# EAGLE design Rib-BabyBack (EAGLE 8.6.3)
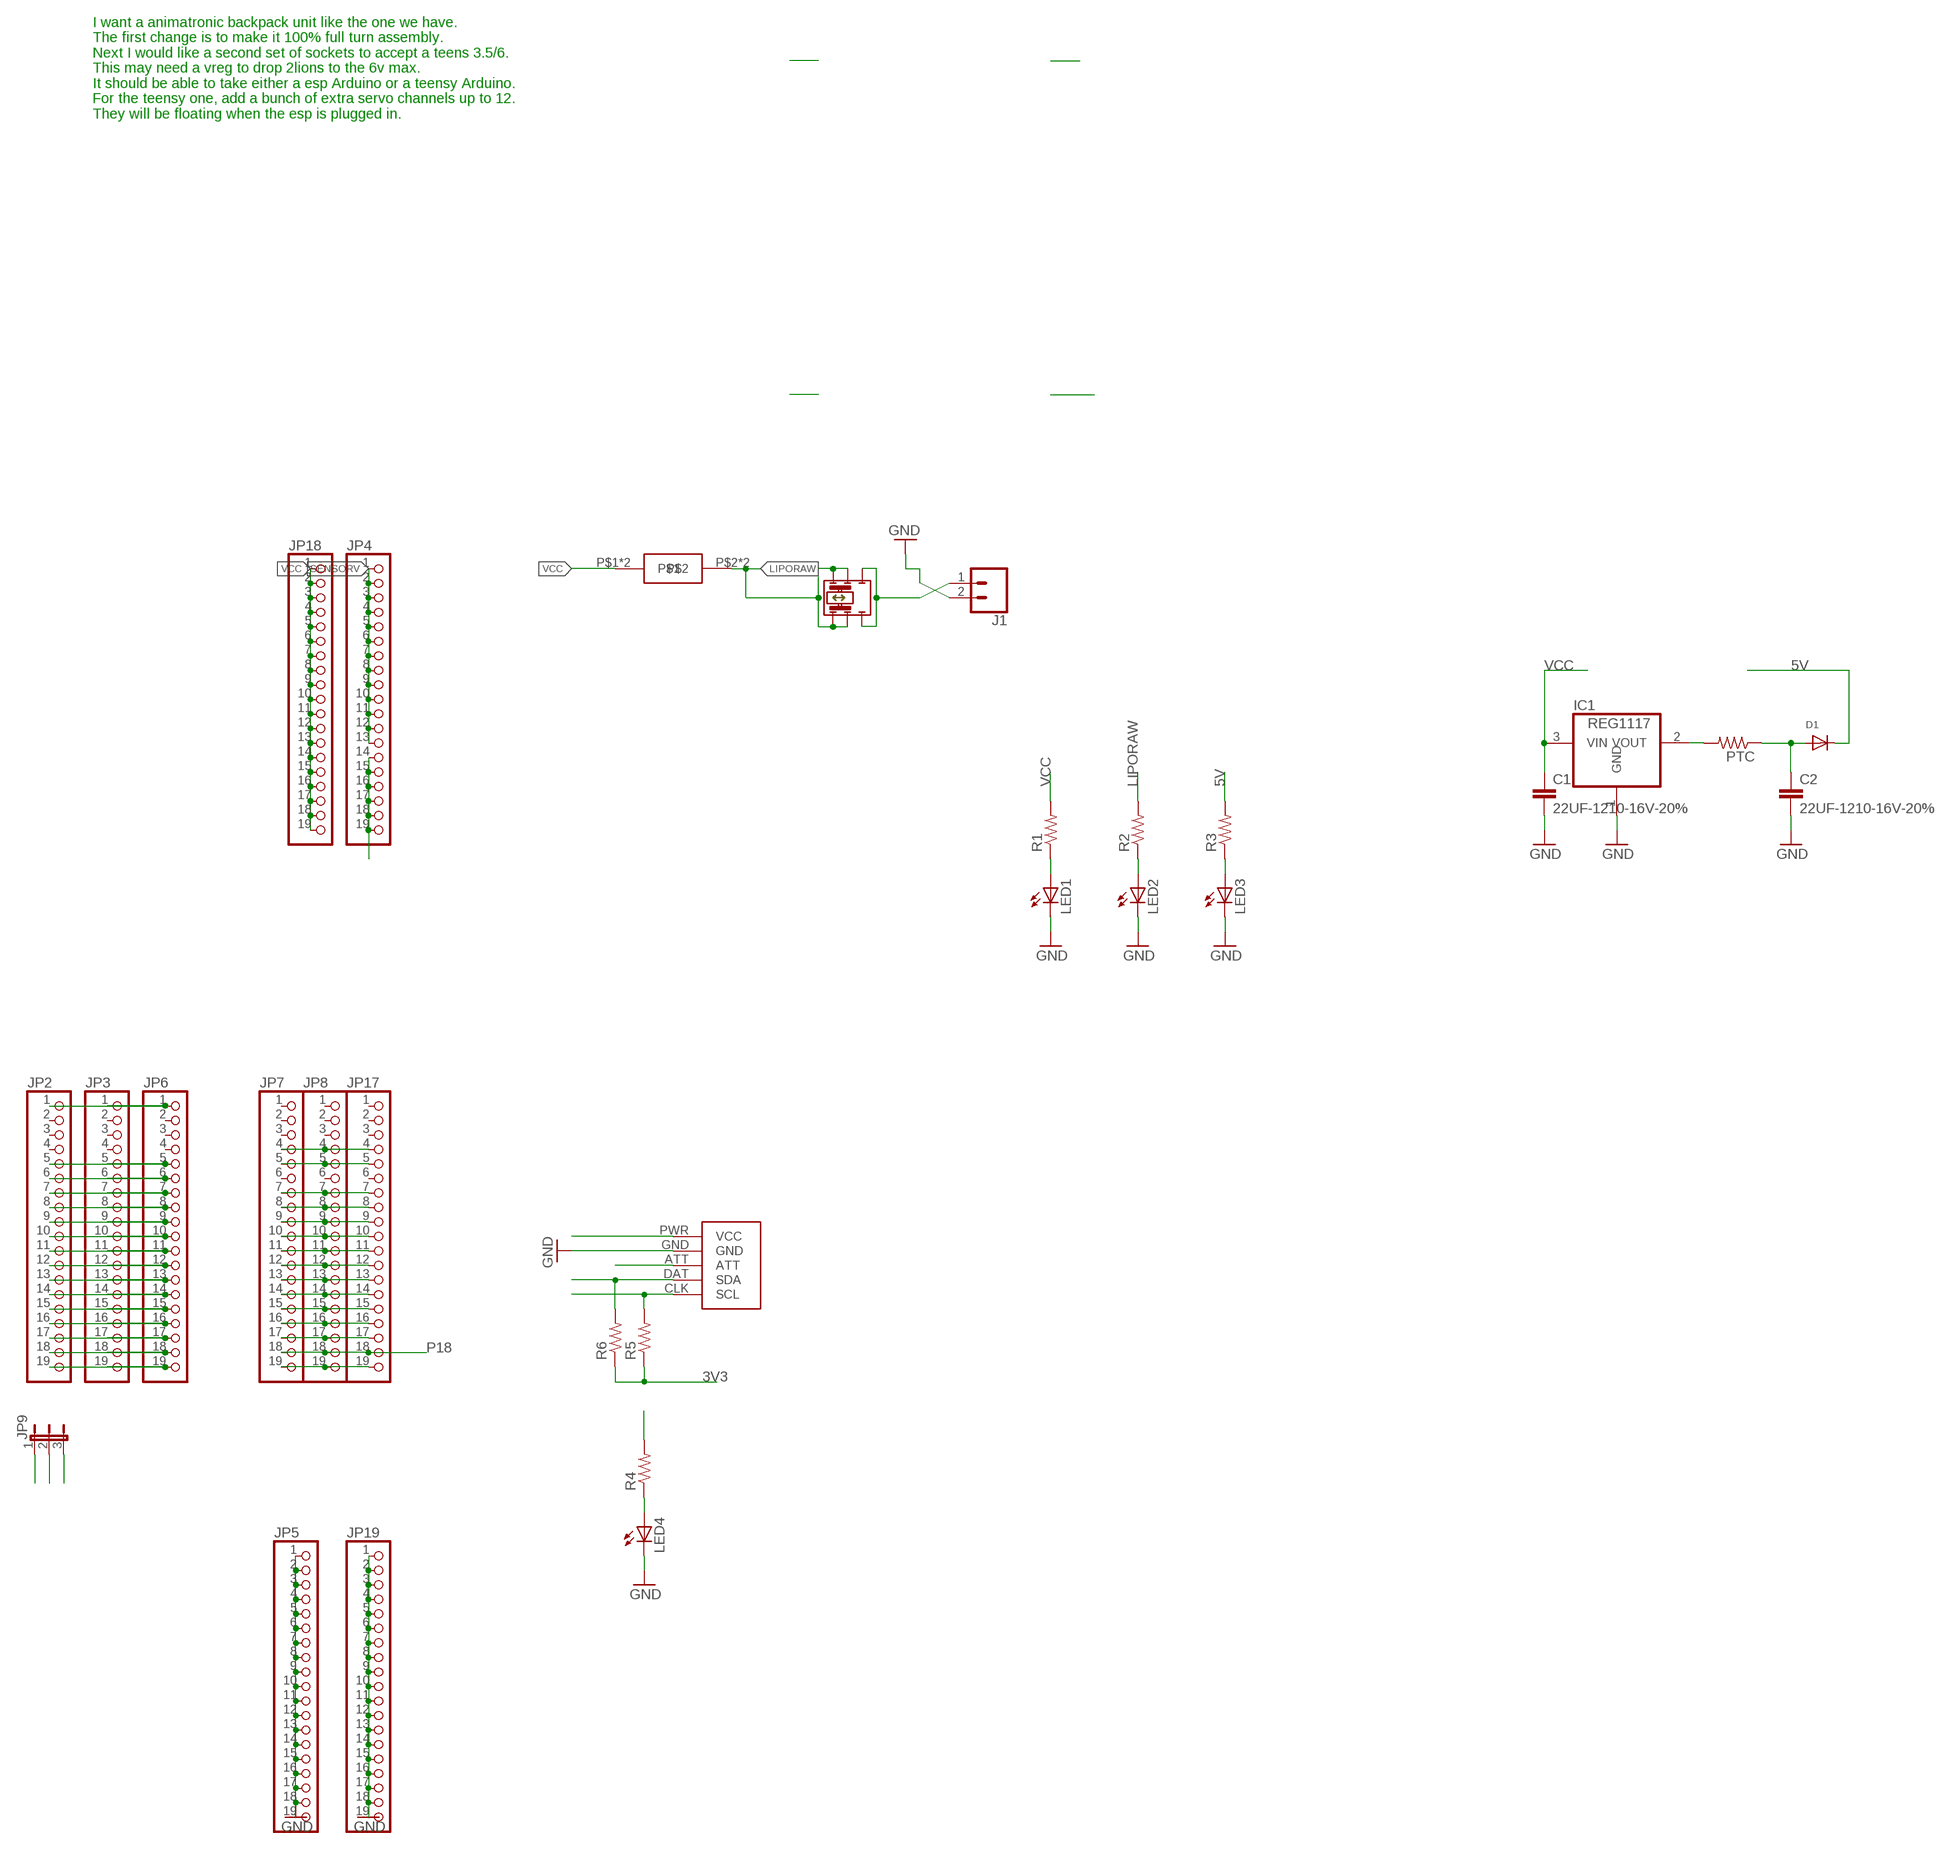
[diagram p0: schematic, sheet 1]

## Parts
C1  22UF-1210-16V-20%  [1210]
C2  22UF-1210-16V-20%  [1210]
D1  DIODESOD-523  [SOD-523]
F4  3557-2  [3557-2]
IC1  REG1117  [SOT223]
J1  CONN_023.5MM_LOCK  [SCREWTERMINAL-3.5MM-2_LOCK]
JP2  PINHD-1X19  [1X19]
JP3  PINHD-1X19  [1X19]
JP4  PINHD-1X19  [1X19]
JP5  PINHD-1X19  [1X19]
JP6  PINHD-1X19  [1X19]
JP7  PINHD-1X19  [1X19]
JP8  PINHD-1X19  [1X19]
JP9  JP2E  [JP2]
JP17  PINHD-1X19  [1X19]
JP18  PINHD-1X19  [1X19]
JP19  PINHD-1X19  [1X19]
LED1  LED_ESML0603  [LED_SML0603]
LED2  LED_ESML0603  [LED_SML0603]
LED3  LED_ESML0603  [LED_SML0603]
LED4  LED_ESML0603  [LED_SML0603]
PTC  R-US_R0805  [R0805]
R1  R-US_R0603  [R0603]
R2  R-US_R0603  [R0603]
R3  R-US_R0603  [R0603]
R4  R-US_R0603  [R0603]
R5  R-US_R0603  [R0603]
R6  R-US_R0603  [R0603]
SW1  DPDT  [GF-126-0327]
U$5  WIICHUCK  [CHUCK]

## Nets
3V3: JP2.19 JP3.19 JP6.19 JP9.1 R5.1 R6.1 U$5.PWR(VCC)
5V: D1.K(C) JP2.1 JP3.1 JP4.14 JP4.15 JP4.16 JP4.17 JP4.18 JP4.19 JP6.1 JP9.3 R3.2
DET: JP2.9 JP3.9 JP6.9 U$5.ATT
GND: C1.2 C2.2 IC1.1(GND) J1.2 JP2.6 JP3.6 JP5.1 JP5.2 JP5.3 JP5.4 JP5.5 JP5.6 JP5.7 JP5.8 JP5.9 JP5.10 JP5.11 JP5.12 JP5.13 JP5.14 JP5.15 JP5.16 JP5.17 JP5.18 JP5.19 JP6.6 JP7.13 JP7.19 JP8.13 JP8.19 JP17.13 JP17.19 JP19.1 JP19.2 JP19.3 JP19.4 JP19.5 JP19.6 JP19.7 JP19.8 JP19.9 JP19.10 JP19.11 JP19.12 JP19.13 JP19.14 JP19.15 JP19.16 JP19.17 JP19.18 JP19.19 LED1.C LED2.C LED3.C LED4.C U$5.GND
LIPORAW: F4.P$2 F4.P$3 R2.2 SW1.A1 SW1.A2 SW1.B1 SW1.B2
N$1: LED4.A R4.1
N$6: C2.1 D1.A PTC.1
N$7: IC1.2(VOUT) PTC.2
N$11: J1.1 SW1.C1 SW1.C2
N$12: JP2.7 JP3.7 JP6.7
N$13: JP2.8 JP3.8 JP6.8
N$15: JP2.10 JP3.10 JP6.10
N$16: JP2.11 JP3.11 JP6.11
N$17: JP2.12 JP3.12 JP6.12
N$18: JP2.13 JP3.13 JP6.13
N$19: JP2.14 JP3.14 JP6.14
N$20: JP2.15 JP3.15 JP6.15
N$21: JP2.16 JP3.16 JP6.16
N$22: JP2.17 JP3.17 JP6.17
N$23: JP2.18 JP3.18 JP6.18
N$24: LED1.A R1.1
N$28: JP7.4 JP8.4 JP17.4
N$29: JP7.5 JP8.5 JP17.5
N$31: JP7.7 JP8.7 JP17.7
N$32: JP7.8 JP8.8 JP17.8
N$33: JP7.9 JP8.9 JP17.9
N$34: JP7.10 JP8.10 JP17.10
N$35: JP7.11 JP8.11 JP17.11
N$36: JP7.12 JP8.12 JP17.12
N$37: LED2.A R2.1
N$38: LED3.A R3.1
P13: JP2.5 JP3.5 JP6.5 R4.2
P18: JP7.18 JP8.18 JP17.18
RX0: JP7.15 JP8.15 JP17.15
SCL: JP7.17 JP8.17 JP17.17 R5.2 U$5.CLK(SCL)
SDA: JP7.14 JP8.14 JP17.14 R6.2 U$5.DAT(SDA)
SENSORV: JP4.1 JP4.2 JP4.3 JP4.4 JP4.5 JP4.6 JP4.7 JP4.8 JP4.9 JP4.10 JP4.11 JP4.12 JP4.13 JP9.2
TX0: JP7.16 JP8.16 JP17.16
VCC: C1.1 F4.P$1 F4.P$4 IC1.3(VIN) JP18.1 JP18.2 JP18.3 JP18.4 JP18.5 JP18.6 JP18.7 JP18.8 JP18.9 JP18.10 JP18.11 JP18.12 JP18.13 JP18.14 JP18.15 JP18.16 JP18.17 JP18.18 JP18.19 R1.2
Unconnected: JP2.2 JP2.3 JP2.4 JP3.2 JP3.3 JP3.4 JP6.2 JP6.3 JP6.4 JP7.1 JP7.2 JP7.3 JP7.6 JP8.1 JP8.2 JP8.3 JP8.6 JP17.1 JP17.2 JP17.3 JP17.6

## Notes on the sheet
- I want a animatronic backpack unit like the one we have.
  The first change is to make it 100% full turn assembly.
  Next I would like a second set of sockets to accept a teens 3.5/6. 
  This may need a vreg to drop 2lions to the 6v max.
  It should be able to take either a esp Arduino or a teensy Arduino.
  For the teensy one, add a bunch of extra servo channels up to 12. 
  They will be floating when the esp is plugged in.

## Library data of the parts
C1 C2 = SparkFun-Capacitors:22UF: 22µF ceramic capacitors A capacitor is a passive two-terminal electrical component used to store electrical energy temporarily in an electric field.
D1 = adafruit:DIODE: Diode SMADIODE - SMA Surface Mount Package 20V 1A Schottky Diode Digikey: 641-1014-6-ND DO-1N4148 - Through Hole Small Current Diode SOD-123 20V 1 A (.5mV Vf) Schottky Diode - Digikey: MBRX120TPMSCT-ND SOD-323 10V 570mA (.38mV Vf, 3ns) Schottky Diode - Digikey: ZLLS410CT-ND SOD-523 30V 30mA Schottky Diode (RB751S-40TE61) - Digikey: RB751S-40TE61CT-ND SOT23-R/W - SOT23 Package (R = Solder Paste/Reflow Ovens, W = Hand-Soldering) BAT54Film 40V 300mA - Digikey: 497-7162-1-ND
F4 = 3557-2:3557-2
IC1 = burr-brown:REG1117: 800mA and 1A Low Dropout (LDO) Positive Regulator 1.8V, 2.5V, 2.85V, 3.3V, 5V, and Adj; MPN: REG1117; OC_FARNELL: 1097566; OC_NEWARK: 14P6981
J1 = SparkFun-Connectors:CONN_02: Multi connection point. Often used as Generic Header-pin footprint for 0.1 inch spaced/style header connections On any of the 0.1 inch spaced packages, you can populate with these: Break Away Headers - Straight <https://www.sparkfun.com/products/116> (PRT-00116) Break Away Male Headers - Right Angle <https://www.sparkfun.com/products/553> (PRT-00553) Female Headers <https://www.sparkfun.com/products/115> (PRT-00115) Break Away Headers - Machine Pin <https://www.sparkfun.com/products/117> (PRT-00117) Break Away Female Headers - Swiss Machine Pin <https://www.sparkfun.com/products/743> (PRT-00743) For SCREWTERMINALS and SPRING TERMINALS visit here: Screw Terimnals on SparkFun.com <https://www.sparkfun.com/search/results?term=Screw+Terminals> (5mm/3.5mm/2.54mm spacing) This device is also useful as a general connection point to wire up your design to another part of your project. Our various solder wires solder well into these plated through hole pads. Hook-Up Wire - Assortment (Stranded, 22 AWG) <https://www.sparkfun.com/products/11375> (PRT-11375) Hook-Up Wire - Assortment (Solid Core, 22 AWG) <https://www.sparkfun.com/products/11367> (PRT-11367) View the entire wire category on our website here <https://www.sparkfun.com/categories/141> Special notes: Molex polarized connector foot print use with: PRT-08233 with associated crimp pins and housings. 2.54_SCREWTERM for use with PRT-10571. 3.5mm Screw Terminal footprints for PRT-08084 5mm Screw Terminal footprints for use with PRT-08432; PROD_ID: CONN-08399
JP2-JP8 JP17-JP19 = headers:PINHD-1X19: PIN HEADER
JP9 = jumper:JP2E: JUMPER
LED1-LED4 = eagle-ltspice:LED_E: LED Source: http://www.osram.convergy.de Source: www.luxeon.com Source: www.kingbright.com; SPICEMODEL: NONE; SPICEPREFIX: D; SPICETYPE: diode
PTC R1-R6 = resistor:R-US_: RESISTOR, American symbol
SW1 = GF-126-0327:DPDT
U$5 = wiichuck:WIICHUCK

## Board
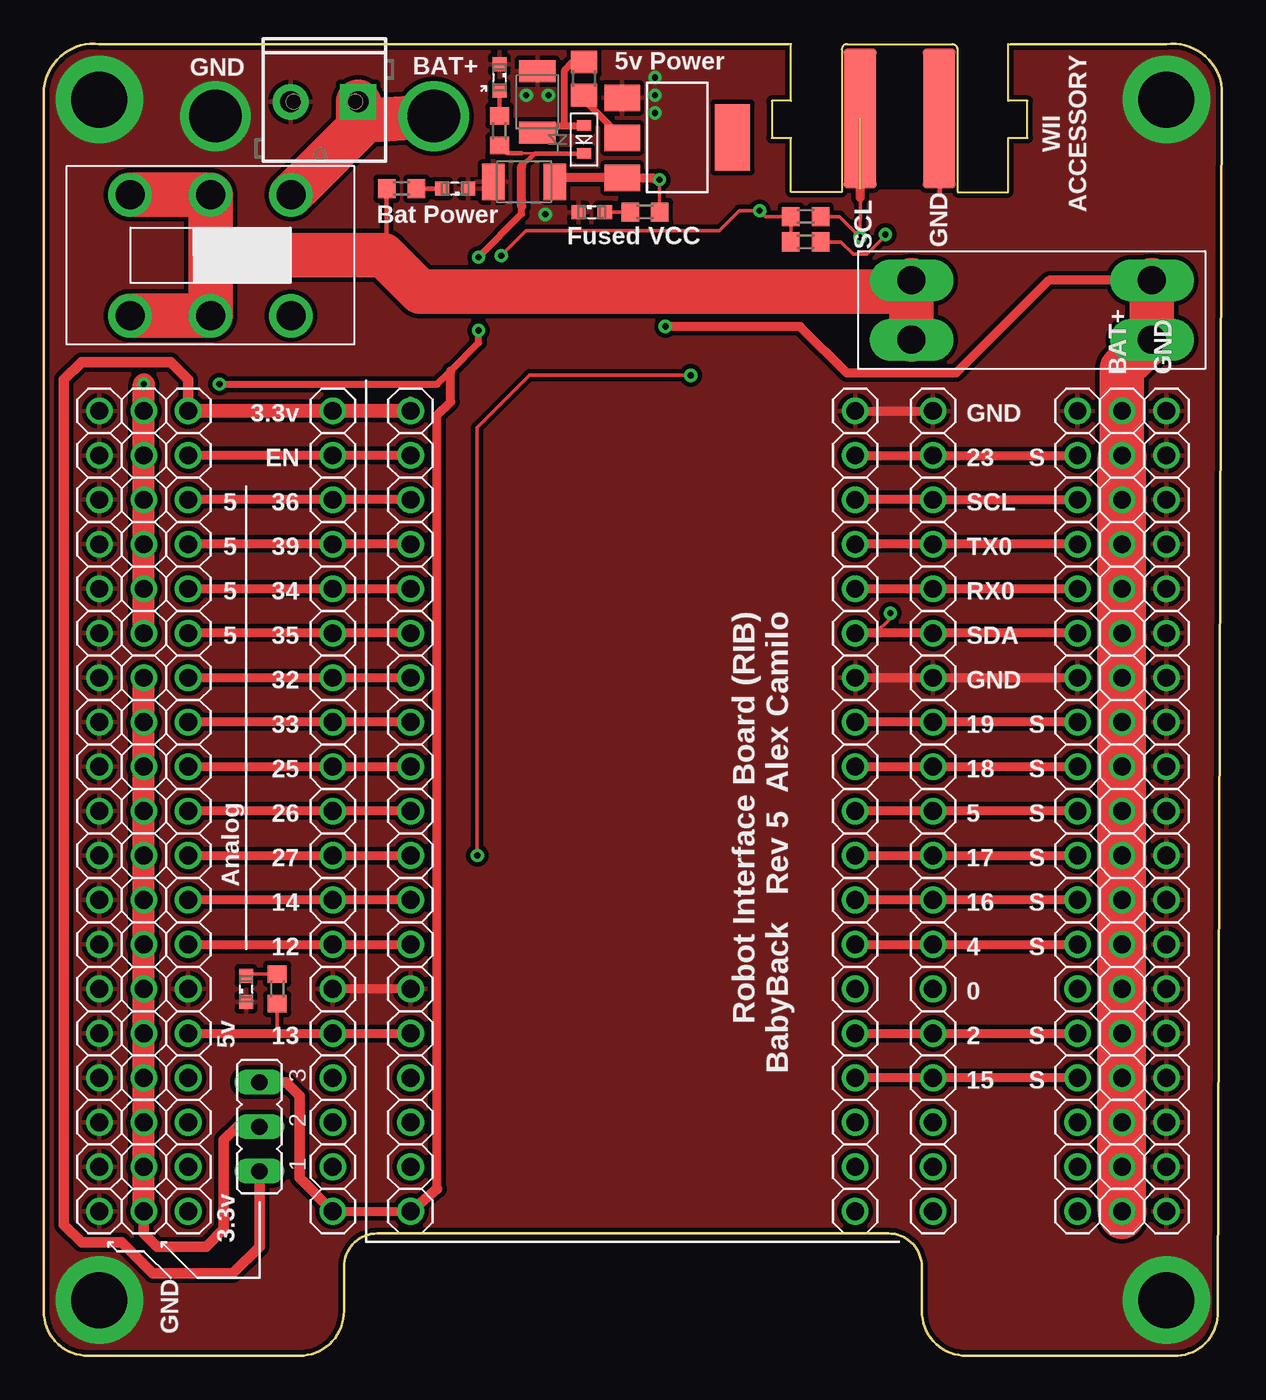
[diagram p1: board, top side]
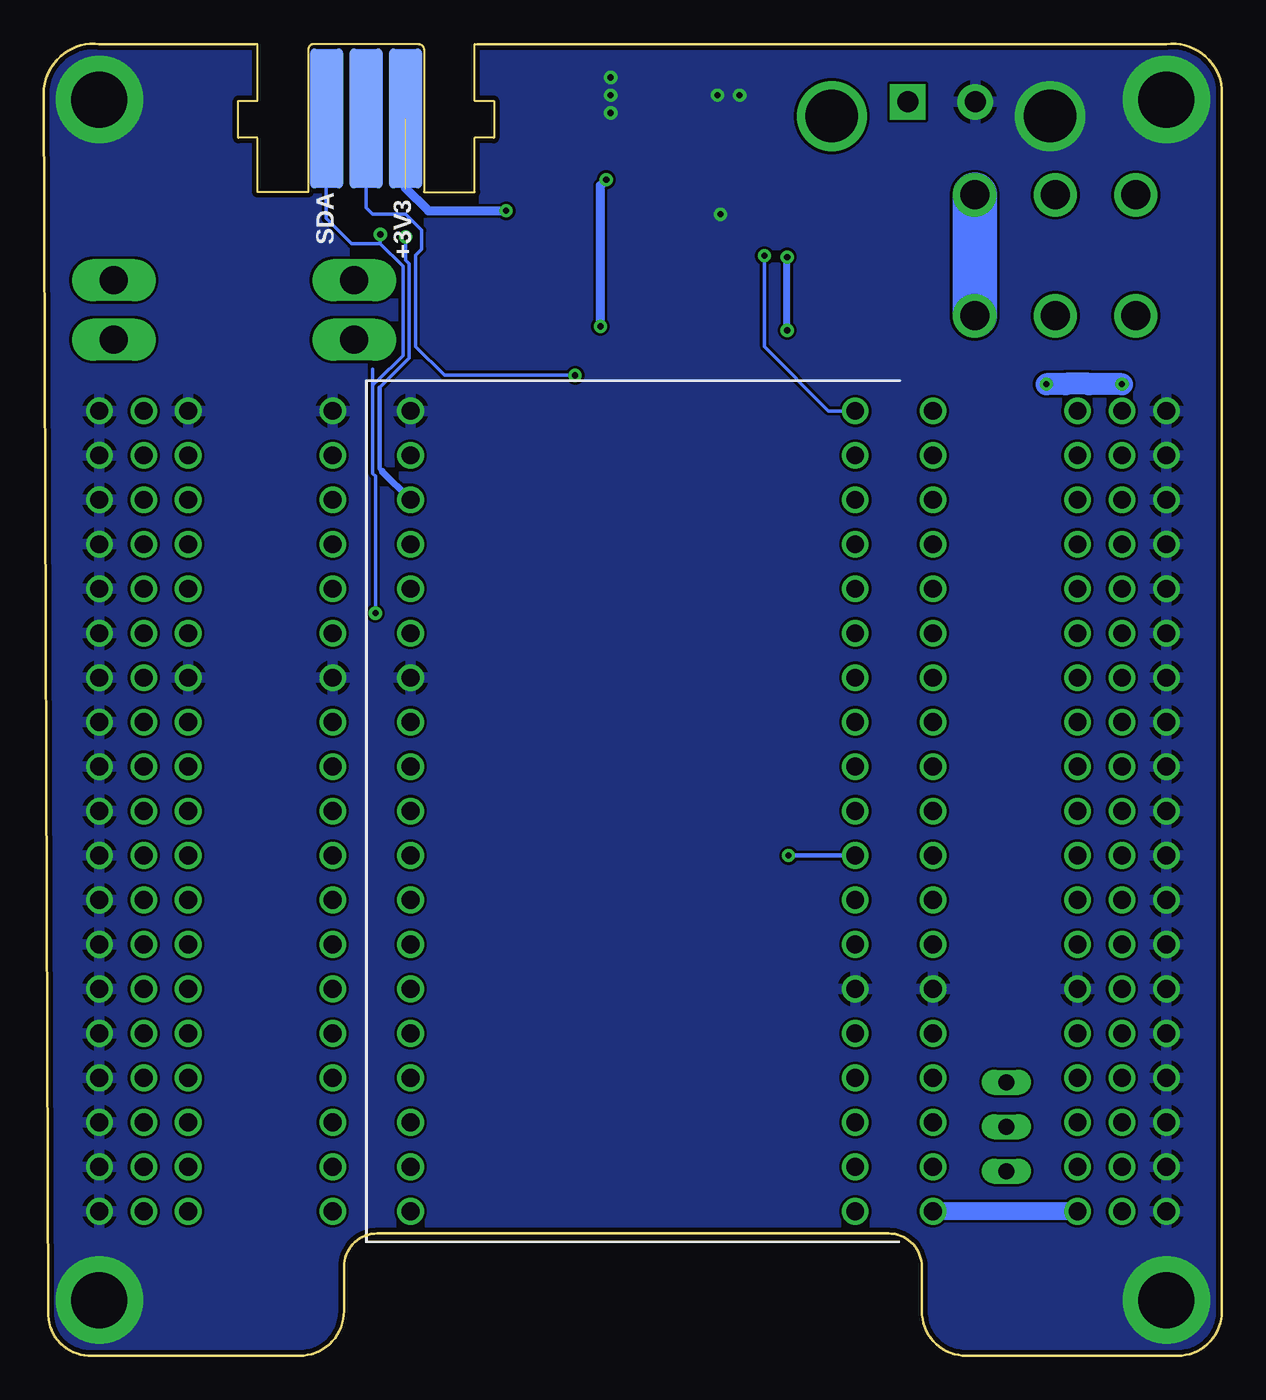
[diagram p2: board, bottom side, seen from below]

Size 67.31 x 74.95 mm. Coordinates in mm from the lower left corner, seen from the top.
Outline: 42.55,74.93 3.17,74.93 arc90 0,72.39 0,2.54 arc90 2.54,0 14.61,0 arc90 17.14,2.54 17.14,5.08 arc-90 19.05,6.99 48.26,6.99 arc-90 50.16,5.08 50.16,2.54 arc90 52.7,0 64.77,0 arc90 67.06,2.54 67.31,72.39 arc90 64.14,74.93 55.24,74.93
Copper layers (1*16): Top 0.035mm / dielectric 1.5mm / Bottom 0.035mm
Design rules "default *": minimum track width 6mil, minimum drill 0.35mm, track to track 6mil, track to pad 6mil, pad to pad 6mil, via to via 6mil, smd to smd 6mil, copper to edge 10mil, drill to drill 6mil, minimum pad ring 10mil, minimum via ring 8mil, stop-mask expansion 4mil, vias tented up to drill 30mil, thermal gap 10mil
tRestrict: area 45.2,66.9 to 52.7,75.6
bRestrict: area 45.2,66.9 to 52.7,75.6

### Footprints (pad centres in the part's own frame; a part is rotated, then mirrored left to right if it is on the bottom)
1210 = smd 1.27 x 2.06: 1 -1.755,0; 2 1.755,0
SOD-523 = smd 0.8 x 0.6: A 0,-0.8; K 0,0.8
3557-2 = drill 1.6 long: P$1 6.87,1.7; P$2 -6.87,1.7; P$3 -6.87,-1.7; P$4 6.87,-1.7
SOT223 = smd 1.499 x 2.007: 1 -2.261,-3.15; 2 0.025,-3.15; 3 2.311,-3.15 | smd 3.81 x 2.007: 4 0,3.15
SCREWTERMINAL-3.5MM-2_LOCK = drill 1.2 pad 2.032 square: 1 -0.178,0 | drill 1.2 pad 2.032: 2 3.678,0
1X19 = drill 1.016: 1 -22.86,0; 2 -20.32,0; 3 -17.78,0; 4 -15.24,0; 5 -12.7,0; 6 -10.16,0; 7 -7.62,0; 8 -5.08,0; 9 -2.54,0; 10 0,0; 11 2.54,0; 12 5.08,0; 13 7.62,0; 14 10.16,0; 15 12.7,0; 16 15.24,0; 17 17.78,0; 18 20.32,0; 19 22.86,0
JP2 = drill 0.914 long: 1 -2.54,0; 2 0,0; 3 2.54,0
LED_SML0603 = smd 0.8 x 0.8: A 0.75,0; C -0.75,0
R0805 = smd 1.3 x 1.5: 1 -0.95,0; 2 0.95,0
R0603 = smd 1 x 1.1: 1 -0.85,0; 2 0.85,0
GF-126-0327 = drill 1.651: A1 -4.597,3.454; A2 -4.597,-3.454; B1 0,3.454; B2 0,-3.454; C1 4.597,3.454; C2 4.597,-3.454
CHUCK = smd 8 x 1.88 bottom: ATT -4.25,0; DAT -4.25,-2.255; PWR -4.25,2.255 | smd 8 x 1.88: CLK -4.25,2.255; GND -4.25,-2.255

### Placement (x,y rotation side)
C1  27.43,67.06 180 top
C2  28.19,71.63 90 top
D1  30.86,69.47 180 top
F4  56.44,59.73 0 top
IC1  36.2,69.6 270 top
J1  17.78,71.63 180 top
JP2  16.51,31.11 90 top
JP3  8.25,31.11 90 top
JP4  5.71,31.11 90 top
JP5  3.17,31.11 90 top
JP6  20.95,31.11 90 top
JP7  46.35,31.11 90 top
JP8  50.8,31.11 90 top
JP9  12.32,13.08 90 top
JP17  59.05,31.11 90 top
JP18  61.59,31.11 90 top
JP19  64.14,31.11 90 top
LED1  31.3,65.33 0 top
LED2  23.5,66.67 180 top
LED3  26.04,73.02 270 top
LED4  11.56,20.95 90 top
PTC  30.86,72.96 270 top
R1  34.35,65.33 0 top
R2  20.45,66.67 180 top
R3  26.04,69.98 270 top
R4  13.33,20.95 270 top
R5  43.53,65.07 0 top
R6  43.53,63.63 0 top
SW1  9.53,62.87 0 top
U$5  48.9,74.93 90 top

### Tracks (layer width: path | path; a pad name or v marks a point on that pad's centre or on a via)
3V3  (via drill 0.35)
  Top 0.203: v26.14,62.84 27.56,64.26 38.61,64.26 39.75,65.41 v40.89,65.41 41.22,65.07 R5.1 R6.1
  Top 0.406: 20.95,54.61 JP6.19
  Top 0.61: JP3.19 8.25,55.75 7.24,56.77 2.16,56.77 1.14,55.75 1.14,7.49 2.16,6.48 4.44,6.48 6.22,4.7 10.79,4.7 12.32,6.22 JP9.1
  Top 0.813: JP3.19 JP2.19 JP6.19
  Bottom 0.203: JP6.19 22.48,53.98 26.14,57.63 v26.14,62.84
  Bottom 0.508: U$5.PWR 46.64,66.71 45.34,65.41 v40.89,65.41
5V  (via drill 0.35)
  Top 0.152: 28.03,68.67 27.99,68.71 26.45,68.71
  Top 0.254: R3.2 26.45,68.71 27.3,68.71 | D1.K 28.03,68.67 27.3,67.94
  Top 0.406: v10.03,55.5 22.48,55.5 23.24,56.26 24.84,57.86 v24.84,58.57 | v24.84,62.76 27.3,65.23 27.3,65.96
  Top 0.508: JP2.1 JP6.1 | 27.3,65.66 27.3,65.96 27.3,67.94 | 23.24,56.26 23.24,54.48 22.48,53.72 22.48,9.53
  Top 0.61: JP2.1 14.61,10.16 14.61,14.86 13.84,15.62 JP9.3 | JP6.1 22.48,9.53
  Top 1.27: JP4.14 JP4.15 JP4.16 JP4.17 JP4.18 JP4.19 v5.71,55.5
  Bottom 0.406: v24.84,58.57 v24.84,62.76
  Bottom 1.016: JP3.1 JP2.1
  Bottom 1.27: v5.71,55.5 7.59,55.5 7.61,55.52 8.9,55.52 8.92,55.5 v10.03,55.5
DET  (via drill 0.35)
  Top 0.203: v36.96,56.01 27.76,56.01 24.77,53.01 v24.77,28.57
  Top 0.508: JP3.9 JP2.9 JP6.9
  Bottom 0.203: 48.9,66.73 48.9,65.58 48.51,65.2 46.63,65.2 45.72,64.29 45.72,63.22 46.08,62.87 46.08,57.66 44.42,56.01 v36.96,56.01 | 48.9,66.73 48.82,66.8 49,66.8 | U$5.ATT 48.9,66.73
  Bottom 0.254: v24.77,28.57 JP6.9
GND  (via drill 0.35, 3, 3.2 pad 5)
  Top 0.254: U$5.GND 51.18,70.65 51.18,66.29
  Top 0.508: JP7.19 JP8.19 | JP7.13 JP8.13 JP17.13 | JP6.6 JP2.6
  other vias: 3.17,3.17 64.14,3.17 3.17,71.75 64.14,71.75 9.81,70.81 27.56,72.01 28.83,72.01 34.92,73.02 34.92,72.01 34.92,70.99 28.65,65.2
  pour Bottom: -8.61,90.7 115.47,86.89 118.01,-37.41 -29.84,-37.41 -11.05,67.67
  pour Top (isolate 0.254): -11.25,76.71 118.08,82.3 117.32,-26.31 -25.37,-26.31 -6.58,12.47
LIPORAW
  Top 0.254: R2.2 19.6,63.04 19.42,62.87
  Top 2.54: SW1.A1 SW1.B1 9.53,62.87 | SW1.A2 SW1.B2 9.53,62.87 | 9.53,62.87 19.42,62.87 21.5,60.78 48.92,60.78 F4.P$2 F4.P$3
N$1
  Top 0.203: R4.1 11.66,21.8 LED4.A
N$6
  Top 0.406: C2.1 29.1,70.27 29.84,70.27 | 29.84,70.27 D1.A | 29.84,70.27 29.75,70.36 29.75,73.44 30.22,73.91 PTC.1
N$7
  Top 0.406: IC1.2 30.86,71.75 PTC.2
N$11  (via drill 3)
  Top 2.54: 18.01,71.57 J1.1 17.96,70.16 SW1.C1 18.36,70.56 v22.29,70.81
  Bottom 2.54: SW1.C2 SW1.C1
N$12
  Top 0.508: JP3.7 JP2.7 JP6.7
N$13
  Top 0.508: JP6.8 JP2.8 JP3.8
N$15
  Top 0.508: JP6.10 JP2.10 JP3.10
N$16
  Top 0.508: JP3.11 JP2.11 JP6.11
N$17
  Top 0.508: JP6.12 JP2.12 JP3.12
N$18
  Top 0.508: JP3.13 JP2.13 JP6.13
N$19
  Top 0.508: JP6.14 JP2.14 JP3.14
N$20
  Top 0.508: JP3.15 JP2.15 JP6.15
N$21
  Top 0.508: JP6.16 JP2.16 JP3.16
N$22
  Top 0.508: JP3.17 JP2.17 JP6.17
N$23
  Top 0.508: JP6.18 JP2.18 JP3.18
N$24
  Top 0.203: LED1.A R1.1
N$28
  Top 0.508: JP17.4 JP8.4 JP7.4
N$29
  Top 0.508: JP7.5 JP8.5 JP17.5
N$31
  Top 0.508: JP7.7 JP8.7 JP17.7
N$32
  Top 0.508: JP17.8 JP8.8 JP7.8
N$33
  Top 0.508: JP7.9 JP8.9 JP17.9
N$34
  Top 0.508: JP17.10 JP8.10 JP7.10
N$35
  Top 0.508: JP7.11 JP8.11 JP17.11
N$36
  Top 0.508: JP17.12 JP8.12 JP7.12
N$37
  Top 0.254: R2.1 LED2.A
N$38
  Top 0.254: R3.1 LED3.A
P13
  Top 0.203: R4.2 13.33,18.41
  Top 0.508: JP3.5 13.33,18.41 JP2.5 JP6.5
P18
  Top 0.508: JP7.18 JP8.18 JP17.18
RX0
  Top 0.508: JP7.15 JP8.15 JP17.15
SCL  (via drill 0.35)  (1 unrouted)
  Top 0.203: 46.64,66.17 46.64,64.93 46.63,64.92 v46.63,63.91 45.47,65.07 R5.2
  Top 0.508: JP7.17 JP8.17 JP17.17 | 46.64,66.17 46.64,66.65
  Bottom 0.203: v46.63,63.91 46.63,62.58 46.43,62.38 46.43,57 48.13,55.3
  Bottom 0.254: 47.98,50.52 48.13,50.67 48.13,55.3
  Bottom 0.406: JP7.17 47.98,50.52
SDA  (via drill 0.35)
  Top 0.152: JP7.14 47.52,41.27
  Top 0.203: 47.52,41.28 47.52,41.27 48.36,42.11 v48.36,42.42 | R6.2 45.54,63.63 46.25,62.92 47.02,62.92 48.08,63.98 v48.08,64.06
  Top 0.508: JP17.14 JP8.14 47.52,41.27 JP7.14
  Bottom 0.203: v48.36,42.42 48.36,50.26 48.51,50.41 48.51,55.45 | 48.51,55.45 48.51,56.36 | 48.51,55.45 48.29,55.68 48.26,55.68 46.79,57.15 46.79,62.23 48.08,63.52 | 48.08,63.52 49.73,63.52 51.18,64.97 51.18,66.8 51.15,66.83 U$5.DAT | v48.08,64.06 48.08,63.52
  Bottom 0.254: U$5.DAT 51.18,70.65 51.18,70.1 51.05,69.98 51.05,68.96
SENSORV
  Top 0.61: JP4.1 5.71,6.99 6.48,6.22 9.27,6.22 10.29,7.24 10.29,12.32 11.05,13.08 JP9.2
  Top 1.27: JP4.1 JP4.2 JP4.3 JP4.4 JP4.5 JP4.6 JP4.7 JP4.8 JP4.9 JP4.10 JP4.11 JP4.12 JP4.13
TX0
  Top 0.508: JP17.16 JP8.16 JP7.16
VCC  (via drill 0.35)
  Top 0.203: R1.2 35.18,65.35 v35.18,67.18
  Top 0.508: v35.18,67.18 34.92,67.18 34.82,67.28 IC1.3 29.42,67.28 C1.1 | F4.P$1 57.42,61.44 52.12,56.13 45.87,56.13 43.2,58.8 v35.51,58.8
  Top 1.016: 61.59,7.95 61.59,11.18
  Top 2.54: F4.P$1 F4.P$4 61.59,56.39 JP18.19 61.59,51.33 | JP18.18 JP18.17 | JP18.16 61.59,44.09 | JP18.15 61.59,41.05 | JP18.14 61.59,38.53 | JP18.13 61.59,36.32 | JP18.12 61.59,33.5 | JP18.11 61.59,30.91 | JP18.10 61.59,28.4 | JP18.9 61.59,25.81 | JP18.8 61.59,23.37 | JP18.7 61.59,20.93 | JP18.6 61.59,18.34 | JP18.5 61.59,15.82 | JP18.4 61.59,13.61 | JP18.3 61.59,11.18 | JP18.2 61.59,7.95
  Top 2.794: JP18.1 61.59,11.18 61.59,13.61 61.59,15.82 61.59,18.34 61.59,20.93 61.59,23.37 61.59,25.81 61.59,28.4 61.59,30.91 61.59,33.5 61.59,36.32 61.59,38.53 61.59,41.05 61.59,44.09 JP18.17 61.59,51.33
  Bottom 0.508: v35.51,58.8 35.51,66.85 v35.18,67.18

### Text on the board
tPlace: GND | BAT+ | 5v Power | WII / ACCESSORY | Bat Power | GND | Fused VCC | SCL | BAT+ | GND | 3.3v | GND | EN | 23 | S | 5 | 36 | SCL | 5 | 39 | TX0 | 5 | 34 | RX0 | Robot Interface Board (RIB) / BabyBack Rev 5 Alex Camilo | 5 | 35 | SDA | 32 | GND | 33 | 19 | S | 25 | 18 | S | Analog | 26 | 5 | S | 27 | 17 | S | 14 | 16 | S | 12 | 4 | S | 0 | 5v | 13 | 2 | S | 15 | S | 3.3v | GND
bPlace: SDA | +3V3